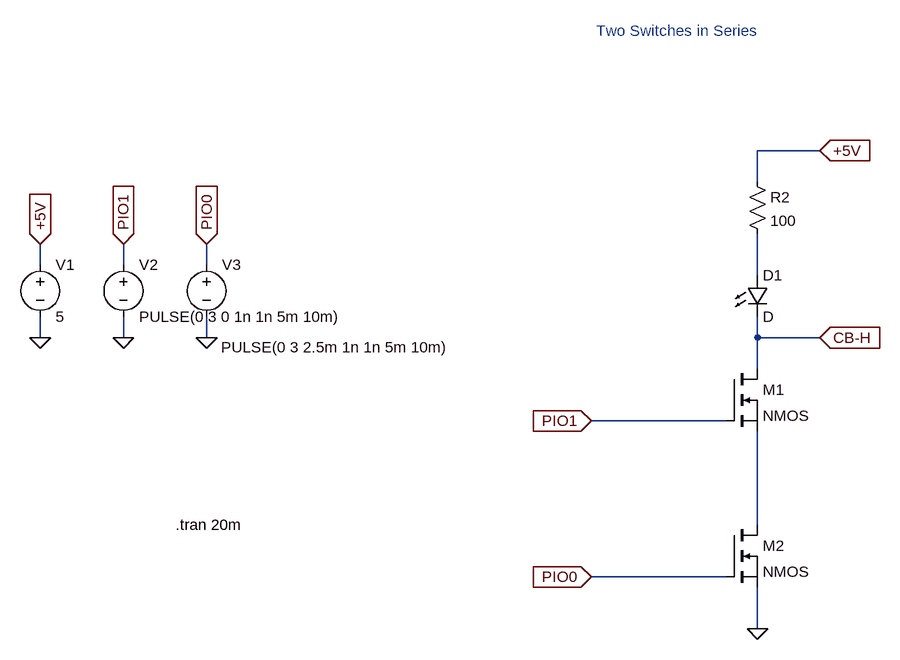
[diagram p0: schematic two_switches_series_ltspice.asc]
two_switches_series_ltspice.asc, the LTspice schematic file:
Version 4
SHEET 1 880 680
WIRE 368 -224 272 -224
WIRE 272 -176 272 -224
WIRE -832 -48 -832 -80
WIRE -704 -48 -704 -80
WIRE -576 -48 -576 -80
WIRE 272 -32 272 -96
WIRE -832 64 -832 32
WIRE -704 64 -704 32
WIRE -576 64 -576 32
WIRE 272 64 272 32
WIRE 368 64 272 64
WIRE 272 112 272 64
WIRE 224 192 16 192
WIRE 272 352 272 208
WIRE 224 432 16 432
WIRE 272 512 272 448
FLAG 368 -224 +5V
IOPIN 368 -224 In
FLAG 368 64 CB-H
IOPIN 368 64 In
FLAG 16 192 PIO1
IOPIN 16 192 In
FLAG -832 64 0
FLAG -704 64 0
FLAG -832 -80 +5V
IOPIN -832 -80 In
FLAG -704 -80 PIO1
IOPIN -704 -80 In
FLAG 272 512 0
FLAG 16 432 PIO0
IOPIN 16 432 In
FLAG -576 64 0
FLAG -576 -80 PIO0
IOPIN -576 -80 In
SYMBOL LED 256 -32 R0
SYMATTR InstName D1
SYMBOL res 256 -192 R0
SYMATTR InstName R2
SYMATTR Value 100
SYMBOL voltage -832 -64 R0
WINDOW 123 0 0 Left 0
WINDOW 39 0 0 Left 0
SYMATTR InstName V1
SYMATTR Value 5
SYMBOL voltage -704 -64 R0
WINDOW 123 0 0 Left 0
WINDOW 39 0 0 Left 0
SYMATTR InstName V2
SYMATTR Value PULSE(0 3 0 1n 1n 5m 10m)
SYMBOL voltage -576 -64 R0
WINDOW 3 22 143 Left 2
WINDOW 123 0 0 Left 0
WINDOW 39 0 0 Left 0
SYMATTR Value PULSE(0 3 2.5m 1n 1n 5m 10m)
SYMATTR InstName V3
SYMBOL nmos 224 112 R0
SYMATTR InstName M1
SYMBOL nmos 224 352 R0
SYMATTR InstName M2
TEXT -624 352 Left 2 !.tran 20m
TEXT 24 -408 Left 2 ;Two Switches in Series

The netlist it stands for:
* two_switches_series_ltspice.asc
D1 N001 CB-H D
R2 +5V N001 100
V1 +5V 0 5
V2 PIO1 0 PULSE(0 3 0 1n 1n 5m 10m)
V3 PIO0 0 PULSE(0 3 2.5m 1n 1n 5m 10m)
M1 CB-H PIO1 N002 N002 NMOS
M2 N002 PIO0 0 0 NMOS
.model D D
.lib standard.dio
.model NMOS NMOS
.model PMOS PMOS
.lib standard.mos
.tran 20m
* Two Switches in Series
.backanno
.end